# EasyEDA Pro project YYT_MiniOdrive_V2.1（改良开尔文走线）.epro, schematic SCH_SimpleFOC
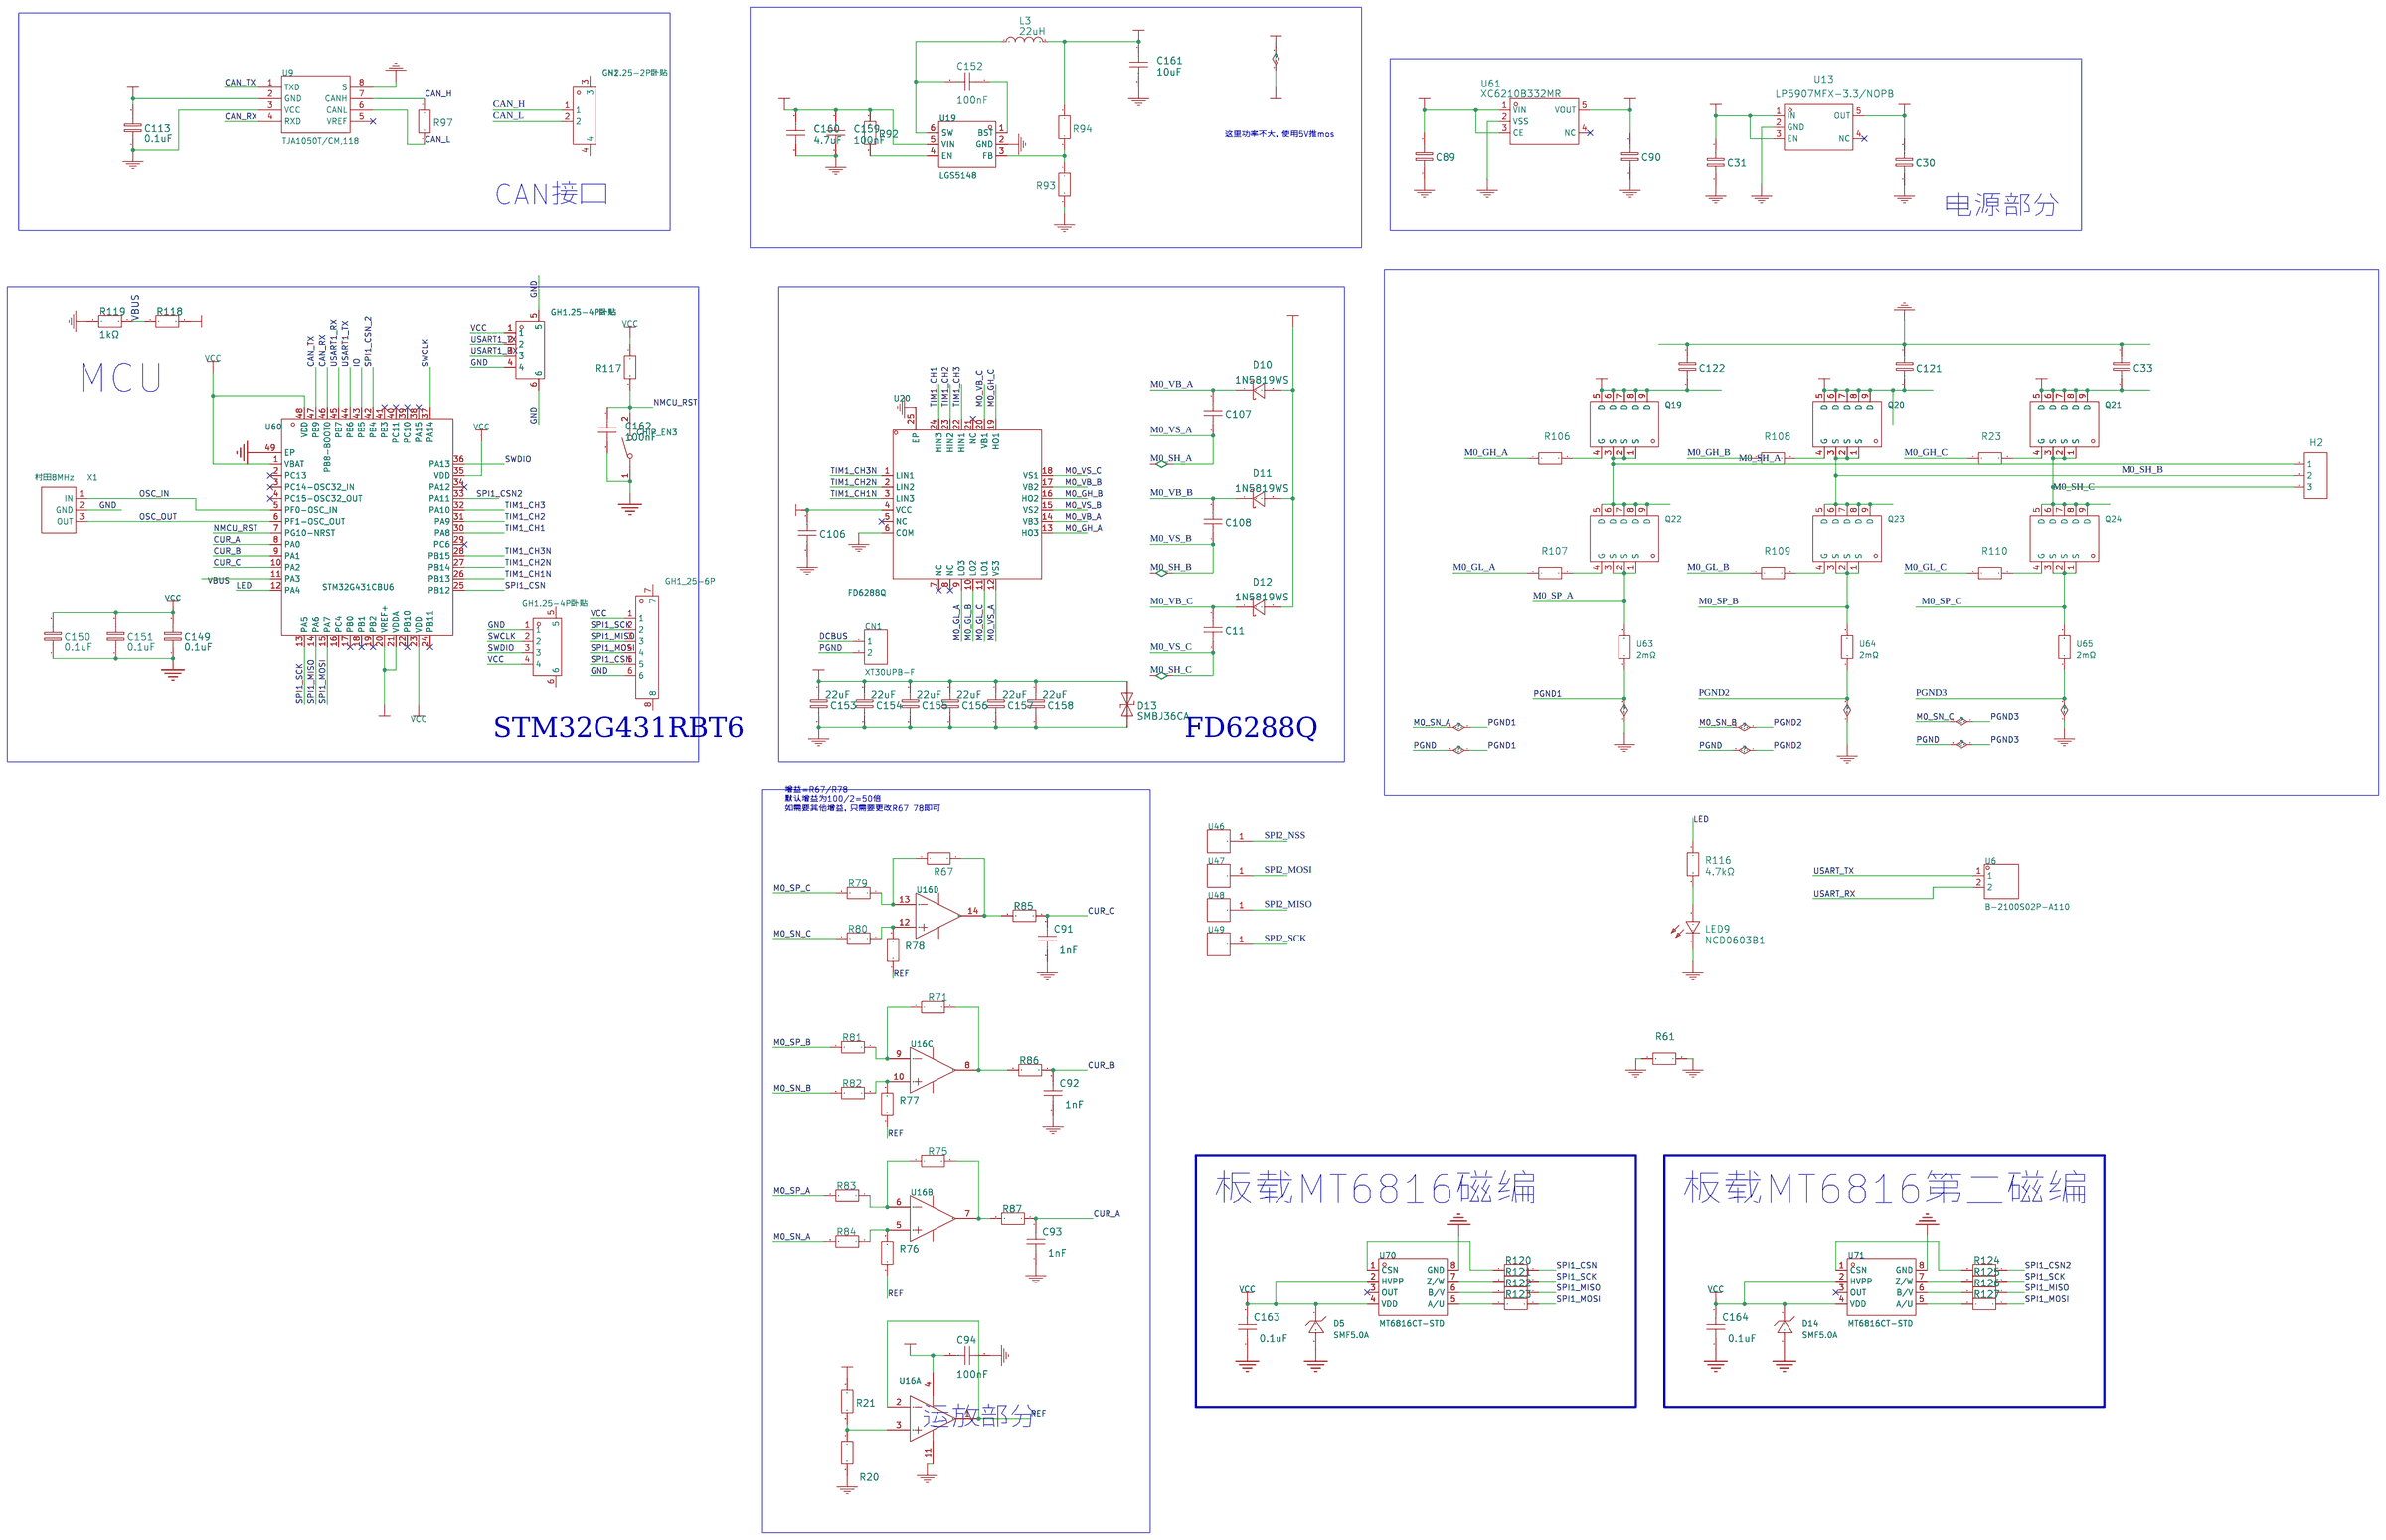
[diagram p0: schematic sheet]

## Parts
C11  1uF  [C0603_SMALL]
C30  1uF  [C0603_SMALL]
C31  1uF  [C0603_SMALL]
C33  10uF  [C1206_SMALL]
C89  10uF  [C0603_SMALL]
C90  10uF  [C0603_SMALL]
C91  1nF  [C0603_SMALL]
C92  1nF  [C0603_SMALL]
C93  1nF  [C0603_SMALL]
C94  100nF  [C0603_SMALL]
C106  10uF  [C0603_SMALL]
C107  1uF  [C0603_SMALL]
C108  1uF  [C0603_SMALL]
C113  0.1uF  [C0603_SMALL]
C121  10uF  [C1206_SMALL]
C122  10uF  [C1206_SMALL]
C149  0.1uF  [C0603_SMALL]
C150  0.1uF  [C0603_SMALL]
C151  0.1uF  [C0603_SMALL]
C152  100nF  [C0603_SMALL]
C153  22uF  [C1206_SMALL]
C154  22uF  [C1206_SMALL]
C155  22uF  [C1206_SMALL]
C156  22uF  [C1206_SMALL]
C157  22uF  [C1206_SMALL]
C158  22uF  [C1206_SMALL]
C159  100nF  [C0603_SMALL]
C160  4.7uF  [C0603_SMALL]
C161  10uF  [C0603_SMALL]
C162  100nF  [C0603_SMALL]
C163  0.1uF  [C0603_SMALL]
C164  0.1uF  [C0603_SMALL]
CHIP_EN3  TS-1088-AR02016  [SW-SMD_L3.9-W3.0-P4.45]
CN1  XT30UPB-F  [CONN-TH_XT30UPB-F]
CN2  GH1.25-2P卧贴  [CONN-SMD_2P-P1.25_X1251WRS-02HF-LPSW]
D5  SMF5.0A  [SOD-123_L2.8-W1.8-LS3.7-RD]
D10  1N5819WS  [SOD-323_L1.8-W1.3-LS2.5-RD]
D11  1N5819WS  [SOD-323_L1.8-W1.3-LS2.5-RD]
D12  1N5819WS  [SOD-323_L1.8-W1.3-LS2.5-RD]
D13  SMBJ36CA  [SMB(DO-214AA)]
D14  SMF5.0A  [SOD-123_L2.8-W1.8-LS3.7-RD]
H2  MR30-M  [MR30-M]
L3  22uH  [IND-SMD_L2.5-W2.0]
LED9  NCD0603B1  [LED0603_RED_SMALL]
Q19  -  [DFN-8_L3.2-W3.1-P0.65-LS3.4-BL]
Q20  -  [DFN-8_L3.2-W3.1-P0.65-LS3.4-BL]
Q21  -  [DFN-8_L3.2-W3.1-P0.65-LS3.4-BL]
Q22  -  [DFN-8_L3.2-W3.1-P0.65-LS3.4-BL]
Q23  -  [DFN-8_L3.2-W3.1-P0.65-LS3.4-BL]
Q24  -  [DFN-8_L3.2-W3.1-P0.65-LS3.4-BL]
R20  1kΩ  [R0603_SMALL]
R21  1kΩ  [R0603_SMALL]
R23  10Ω  [R0603_SMALL]
R61  0Ω  [R0603_SMALL]
R67  100kΩ  [R0603_SMALL]
R71  100kΩ  [R0603_SMALL]
R75  100kΩ  [R0603_SMALL]
R76  100kΩ  [R0603_SMALL]
R77  100kΩ  [R0603_SMALL]
R78  100kΩ  [R0603_SMALL]
R79  2kΩ  [R0603_SMALL]
R80  2kΩ  [R0603_SMALL]
R81  2kΩ  [R0603_SMALL]
R82  2kΩ  [R0603_SMALL]
R83  2kΩ  [R0603_SMALL]
R84  2kΩ  [R0603_SMALL]
R85  22Ω  [R0603_SMALL]
R86  22Ω  [R0603_SMALL]
R87  22Ω  [R0603_SMALL]
R92  10kΩ  [R0603_SMALL]
R93  10kΩ  [R0603_SMALL]
R94  52.3kΩ  [R0603_SMALL]
R97  120Ω  [R0603_SMALL]
R106  10Ω  [R0603_SMALL]
R107  10Ω  [R0603_SMALL]
R108  10Ω  [R0603_SMALL]
R109  10Ω  [R0603_SMALL]
R110  10Ω  [R0603_SMALL]
R116  4.7kΩ  [R0603_SMALL]
R117  10kΩ  [R0603_SMALL]
R118  10kΩ  [R0603_SMALL]
R119  1kΩ  [R0603_SMALL]
R120  22Ω  [R0603_SMALL]
R121  22Ω  [R0603_SMALL]
R122  22Ω  [R0603_SMALL]
R123  22Ω  [R0603_SMALL]
R124  22Ω  [R0603_SMALL]
R125  22Ω  [R0603_SMALL]
R126  22Ω  [R0603_SMALL]
R127  22Ω  [R0603_SMALL]
U6  B-2100S02P-A110  [HDR-TH_2P-P2.54-V-M-1]
U9  TJA1050T/CM,118  [soic-8_l5.0-w4.0-p1.27-ls6.0-bl]
U13  LP5907MFX-3.3/NOPB  [SOT-23-5_L3.0-W1.7-P0.95-LS2.8-BR]
U16  RS724XQ  [TSSOP-14_L5.0-W4.4-P0.65-LS6.4-BL]  (sections 1,2,3,4)
U19  LGS5148  [SOT-23-6_L2.9-W1.6-P0.95-LS2.8-BL]
U20  FD6288Q  [QFN-24_L4.0-W4.0-P0.50-BL-EP2.6]
U46  -  [焊盘]
U47  -  [焊盘]
U48  -  [焊盘]
U49  -  [焊盘]
U60  STM32G431CBU6  [UFQFPN-48_L7.0-W7.0-P0.50-BL-EP]
U61  XC6210B332MR  [SOT-25_L3.0-W1.6-P0.95-LS2.8-BL]
U63  2mΩ  [R1206_SMALL]
U64  2mΩ  [R1206_SMALL]
U65  2mΩ  [R1206_SMALL]
U66  GH1.25-4P卧贴  [CONN-SMD_4P-P1.25_GH1.25-4P]
U67  GH1.25-4P卧贴  [CONN-SMD_4P-P1.25_GH1.25-4P]
U69  GH1_25-6P  [CONN-SMD_A1257WR-S-6P]
U70  MT6816CT-STD  [SOP-8_L4.9-W3.9-P1.27-LS6.0-BL]
U71  MT6816CT-STD  [SOP-8_L4.9-W3.9-P1.27-LS6.0-BL]
X1  村田8MHz  [OSC-SMD_3P-L3.2-W1.3-P1.20]

## Library data of the parts
C11 C30 C31 C91-C93 C107 C108 C152 C159-C164 = CC0603KRX5R8BB105: 容值:1uF;精度:±10%;额定电压:25V;材质(温度系数):X5R;; LCSC Part Name: 1uF ±10% 25V; Supplier Part: C14664; Manufacturer: YAGEO(国巨); Supplier Footprint: 0603; JLCPCB Part Class: Extended Part; Datasheet: https://atta.szlcsc.com/upload/public/pdf/source/20160606/1465200209684.pdf; Supplier: LCSC; Tolerance: ±10%; Voltage Rated: 25V; Temperature Coefficient: X5R; Check: true
C33 C121 C122 C153-C158 = CL31A106KBHNNNE: 容值:10uF;精度:±10%;额定电压:50V;材质(温度系数):X5R;; LCSC Part Name: 10uF ±10% 50V; Supplier Part: C13585; Manufacturer: SAMSUNG(三星); Supplier Footprint: 1206; JLCPCB Part Class: Basic Part; Datasheet: https://atta.szlcsc.com/upload/public/pdf/source/20160218/1457707763339.pdf; Supplier: LCSC; Tolerance: ±10%; Voltage Rated: 50V; Temperature Coefficient: X5R; Check: true
C89 C90 C113 C149-C151 = GRM188R6YA106MA73D: 容值:10uF;精度:±20%;额定电压:35V;材质(温度系数):-;; LCSC Part Name: 10uF ±20% 35V; Supplier Part: C194427; Manufacturer: muRata(村田); Supplier Footprint: 0603; JLCPCB Part Class: Extended Part; Datasheet: https://atta.szlcsc.com/upload/public/pdf/source/20210128/C194427_FCA3640823207DDB58700A82F1A19B5F.pdf; Supplier: LCSC; Tolerance: ±20%; Voltage Rated: 35V; Check: true
C94 = CC0603KRX5R8BB105: 容值:1uF;精度:±10%;额定电压:25V;材质(温度系数):X5R;; LCSC Part Name: 1uF ±10% 25V; Supplier Part: C14663; Manufacturer: YAGEO(国巨); Manufacturer Part: CC0603KRX7R9BB104; Supplier Footprint: 0603; JLCPCB Part Class: Extended Part; Datasheet: https://atta.szlcsc.com/upload/public/pdf/source/20160606/1465200209684.pdf; Supplier: LCSC; Tolerance: ±10%; Voltage Rated: 25V; Temperature Coefficient: X5R; Check: true
C106 = CL10A106MA8NRNC: 容值:10uF;精度:±20%;额定电压:25V;材质(温度系数):X5R;; LCSC Part Name: 10uF ±20% 25V; Supplier Part: C96446; Manufacturer: SAMSUNG(三星); Supplier Footprint: 0603; JLCPCB Part Class: Basic Part; Datasheet: https://atta.szlcsc.com/upload/public/pdf/source/20160218/1457707763339.pdf; Supplier: LCSC; Tolerance: ±20%; Voltage Rated: 25V; Temperature Coefficient: X5R; Check: true
CHIP_EN3 = TS-1088-AR02016: 触点电流:50mA;额定电压(DC):12V;绝缘电阻:100MΩ;电路结构:单刀单掷;安装方式:立贴;作用力:160gf@±50gf;机械寿命:10万次;带支架:否;; LCSC Part Name: 4*3*2mm 立贴 轻触开关; Supplier Part: C720477; Manufacturer: XUNPU(讯普); Supplier Footprint: SMD; JLCPCB Part Class: 扩展库; Datasheet: https://atta.szlcsc.com/upload/public/pdf/source/20200810/C720475_60D09DD6C54279ADDB2DC25100F1CC11.pdf; Supplier: LCSC; Contact Current: 50mA; Voltage Rating (DC): 12V; Insulation Resistance: 100MΩ; Circuit: 单刀单掷; Mounting Style: 立贴; Actuator Style: 圆形按钮; Actuator/Cap Color: 黑色; Operating Force: 160gf@±50gf; Mechanical Life: 10万次; Operating Temperature: -30℃~+80℃; Pin Style: SMD接片; Switch Length: 4mm; Switch Width: 3mm; Switch Height: 2mm; Strike Gundam: 否
CN1 = XT30UPB-F: 模型插头连接器; Supplier Part: C108769; Manufacturer: AMASS(艾迈斯); Supplier Footprint: 间距5mm; JLCPCB Part Class: Extended Part; Datasheet: https://atta.szlcsc.com/upload/public/pdf/source/20180126/C108769_15169557890251308829.pdf; Supplier: LCSC
CN2 = GH1.25-2P卧贴_C9900015099: Supplier Part: C9900015099; JLCPCB Part Class: 扩展库; Supplier: LCSC
D5 D14 = SMF5.0A_C284108: 反向截止电压(Vrwm):5V;最大钳位电压:9.2V;峰值脉冲电流(Ipp)@10/1000us:21.74A;击穿电压:6.4V;; Supplier Part: C284108; Manufacturer: DOWO(东沃); Supplier Footprint: SOD-123; JLCPCB Part Class: 扩展库; Datasheet: https://atta.szlcsc.com/upload/public/pdf/source/20180913/C284108_88CC9DECD7829E4A8E23B214D270FEE7.pdf; Supplier: LCSC; Reverse Stand-Off Voltage (Vrwm): 5V; Maximum Clamping Voltage: 9.2V; Peak Pulse Current (Ipp)@10/1000us: 21.74A; Breakdown Voltage: 6.4V; Type: TVS
D10-D12 = 1N5819WS_C191023: 直流反向耐压(Vr):40V;平均整流电流(Io):1A;正向压降(Vf):600mV@1A;; LCSC Part Name: 40V 1A 600mV@1A; Supplier Part: C191023; Manufacturer: Hottech(合科泰); Supplier Footprint: SOD-323; JLCPCB Part Class: Basic Part; Datasheet: https://atta.szlcsc.com/upload/public/pdf/source/20220428/3CB86FD8D28D653594B4E35F9D5AEFD9.pdf; Supplier: LCSC; Reverse Voltage (Vr): 40V; Average Rectified Current (Io): 1A; Forward Voltage (Vf@If): 600mV@1A
D13 = SMBJ36CA_C114002: 极性:双向;反向截止电压(Vrwm):36V;击穿电压(最小值):40V;峰值脉冲电流(Ipp)@10/1000μs:10.3A;最大钳位电压:58.1V;; LCSC Part Name: 双向 36V; Supplier Part: C114002; Manufacturer: MDD; JLCPCB Part Class: Extended Part; Datasheet: https://atta.szlcsc.com/upload/public/pdf/source/20180124/C114002_15167561198911295053.pdf; Supplier: LCSC; Polarity: 双向; Reverse Stand-Off Voltage (Vrwm): 36V; Breakdown Voltage (Min): 40V; Peak Pulse Current (Ipp)@10/1000μs: 10.3A; Maximum Clamping Voltage: 58.1V
H2 = MR30-M: Supplier Part: C146690; Supplier: LCSC; Check: true
L3 = FTC252012S100MBCA: 电感值:10uH;精度:±20%;额定电流:1.2A;饱和电流(Isat):1.6A;类型:一体成型电感;; LCSC Part Name: 10uH ±20% 1.6A; Supplier Part: C5832376; Manufacturer: cjiang(长江微电); Supplier Footprint: SMD,2x2.5mm; JLCPCB Part Class: Extended Part; Datasheet: https://atta.szlcsc.com/upload/public/pdf/source/20230602/8FFEDA9C0247A92A0D4B67554BFE4091.pdf; Supplier: LCSC; Tolerance: ±20%; Rated Current: 1.2A; Saturation Current (Isat): 1.6A; DC Resistance (DCR): 330mΩ; Type: 一体成型电感
LED9 = NCD0603B1: 发光颜色:蓝灯;; LCSC Part Name: 蓝灯; Supplier Part: C84266; Manufacturer: 国星光电; Supplier Footprint: 0603; JLCPCB Part Class: Extended Part; Datasheet: https://atta.szlcsc.com/upload/public/pdf/source/20200820/C84266_6A3CDBEFA72C6CAD68EDA53474ADAE6C.pdf; Supplier: LCSC; Emitted Color: 蓝灯
Q19-Q24 = AP30H50Q: 类型:N沟道;漏源电压(Vdss):30V;连续漏极电流(Id):40A;功率(Pd):30W;导通电阻(RDS(on)@Vgs,Id):6.5m@10V,15A;阈值电压(Vgs(th)@Id):1.5V@250uA;栅极电荷(Qg@Vgs):13.3nC@10V;输入电容(Ciss@Vds):1.116nF@15V;反向传输电容(Crss@Vds):152pF@15V;工作温度:+150@(Tj);; LCSC Part Name: N沟道 30V 40A; Supplier Part: C2849568; Manufacturer: ALLPOWER(铨力); Supplier Footprint: PDFN3x3-8L; Datasheet: https://atta.szlcsc.com/upload/public/pdf/source/20210723/C2849568_A97FA0A1CF9FB2B108B0B183000AF288.pdf; Supplier: LCSC; Type: N沟道; Drain Source Voltage (Vdss): 30V; Continuous Drain Current (Id): 40A; Power Dissipation (Pd): 30W; Drain Source On Resistance (RDS(on)@Vgs,Id): 6.5m@10V,15A; Gate Threshold Voltage (Vgs(th)@Id): 1.5V@250uA; Total Gate Charge (Qg@Vgs): 13.3nC@10V; Input Capacitance (Ciss@Vds): 1.116nF@15V; Reverse Transfer Capacitance (Crss@Vds): 152pF@15V; Operating Temperature: +150@(Tj); JLCPCB Part Class: Extended Part
R20 R21 = SCR0603J1K: 阻值:1kΩ;精度:±5%;; LCSC Part Name: 1kΩ ±5%; Supplier Part: C3017736; Manufacturer: VO(翔胜); Supplier Footprint: 0603; JLCPCB Part Class: Extended Part; Datasheet: https://atta.szlcsc.com/upload/public/pdf/source/20220513/247AF9639BA21CF93567DC289CCC6A22.pdf; Supplier: LCSC; Tolerance: ±5%; Check: true
R23 R106-R110 = 0603WAF100JT5E: 电阻类型:厚膜电阻;阻值:10Ω;精度:±1%;功率:100mW;最大工作电压:75V;温度系数:±400ppm/℃;; LCSC Part Name: 10Ω ±1% 100mW 厚膜电阻; Supplier Part: C22859; Manufacturer: UNI-ROYAL(厚声); Supplier Footprint: 0603; JLCPCB Part Class: Basic Part; Datasheet: https://atta.szlcsc.com/upload/public/pdf/source/20200306/C422600_1E6D84923E4A46A82E41ADD87F860B5C.pdf; Supplier: LCSC; Type: 厚膜电阻; Tolerance: ±1%; Power(Watts): 100mW; Overload Voltage (Max): 75V; Temperature Coefficient: ±400ppm/℃; Operating Temperature Range: -55℃~+155℃; Check: true
R61 = 0603WAF0000T5E: 电阻类型:厚膜电阻;阻值:0Ω;精度:±1%;功率:100mW;最大工作电压:75V;; LCSC Part Name: 0Ω ±1% 100mW 厚膜电阻; Supplier Part: C21189; Manufacturer: UNI-ROYAL(厚声); Supplier Footprint: 0603; JLCPCB Part Class: Basic Part; Datasheet: https://atta.szlcsc.com/upload/public/pdf/source/20200306/C422600_1E6D84923E4A46A82E41ADD87F860B5C.pdf; Supplier: LCSC; Type: 厚膜电阻; Tolerance: ±1%; Power(Watts): 100mW; Overload Voltage (Max): 75V; Operating Temperature Range: -55℃~+155℃; Check: true
R67 R71 R75-R78 = RT0603BRD07100KL: 电阻类型:薄膜电阻;阻值:100kΩ;精度:±0.1%;功率:100mW;; LCSC Part Name: 100kΩ ±0.1% 100mW; Supplier Part: C122538; Manufacturer: YAGEO(国巨); Supplier Footprint: 0603; JLCPCB Part Class: Extended Part; Datasheet: https://atta.szlcsc.com/upload/public/pdf/source/20170721/C122538_1500619326323834092.pdf; Supplier: LCSC; Type: 薄膜电阻; Tolerance: ±0.1%; Power(Watts): 100mW; Temperature Coefficient: ±25ppm/℃; Overload Voltage (Max): 75V; Operating Temperature Range: -55℃~+155℃; Check: true
R79-R84 = 0603WAF2001T5E: 阻值:2kΩ;精度:±1%;功率:100mW;温度系数:±100ppm/℃;电阻类型:厚膜电阻;; LCSC Part Name: 2kΩ ±1% 100mW 厚膜电阻; Supplier Part: C22975; Manufacturer: UNI-ROYAL(厚声); Supplier Footprint: 0603; JLCPCB Part Class: Basic Part; Datasheet: https://atta.szlcsc.com/upload/public/pdf/source/20200306/C422600_1E6D84923E4A46A82E41ADD87F860B5C.pdf; Supplier: LCSC; Tolerance: ±1%; Power(Watts): 100mW; Overload Voltage (Max): 75V; Temperature Coefficient: ±100ppm/℃; Type: 厚膜电阻; Operating Temperature Range: -55℃~+155℃; Check: true
R85-R87 R120-R127 = 0603WAF220JT5E: 阻值:22Ω;精度:±1%;功率:100mW;温度系数:±100ppm/℃;电阻类型:厚膜电阻;; LCSC Part Name: 22Ω ±1% 100mW 厚膜电阻; Supplier Part: C23345; Manufacturer: UNI-ROYAL(厚声); Supplier Footprint: 0603; JLCPCB Part Class: Basic Part; Datasheet: https://atta.szlcsc.com/upload/public/pdf/source/20200306/C422600_1E6D84923E4A46A82E41ADD87F860B5C.pdf; Supplier: LCSC; Tolerance: ±1%; Power(Watts): 100mW; Overload Voltage (Max): 75V; Temperature Coefficient: ±100ppm/℃; Type: 厚膜电阻; Operating Temperature Range: -55℃~+155℃; Check: true
R92 R93 R117-R119 = CR0603JA0103G: 电阻类型:厚膜电阻;阻值:10kΩ;精度:±5%;功率:100mW;温度系数:±200ppm/℃;最大工作电压:50V;工作温度范围:-55℃~+125℃;; LCSC Part Name: 10kΩ ±5% 100mW; Supplier Part: C101254; Manufacturer: LIZ(丽智电子); Supplier Footprint: 0603; JLCPCB Part Class: Extended Part; Datasheet: https://atta.szlcsc.com/upload/public/pdf/source/20170408/1491631441449.pdf; Supplier: LCSC; Type: 厚膜电阻; Tolerance: ±5%; Power(Watts): 100mW; Temperature Coefficient: ±200ppm/℃; Overload Voltage (Max): 50V; Operating Temperature Range: -55℃~+125℃; Check: true
R94 = 0603WAF5232T5E: 电阻类型:厚膜电阻;阻值:52.3kΩ;精度:±1%;功率:100mW;最大工作电压:75V;温度系数:±100ppm/℃;; LCSC Part Name: 52.3kΩ ±1% 100mW 厚膜电阻; Supplier Part: C23198; Manufacturer: UNI-ROYAL(厚声); Supplier Footprint: 0603; JLCPCB Part Class: Extended Part; Datasheet: https://atta.szlcsc.com/upload/public/pdf/source/20200306/C422600_1E6D84923E4A46A82E41ADD87F860B5C.pdf; Supplier: LCSC; Type: 厚膜电阻; Tolerance: ±1%; Power(Watts): 100mW; Overload Voltage (Max): 75V; Temperature Coefficient: ±100ppm/℃; Operating Temperature Range: -55℃~+155℃; Check: true
R97 = RC0603FR-07120RL: 阻值:120Ω;精度:±1%;功率:100mW;温度系数:±100ppm/℃;最大工作电压:75V;工作温度范围:-55℃~+155℃;; LCSC Part Name: 120Ω ±1% 100mW; Supplier Part: C114640; Manufacturer: YAGEO(国巨); Supplier Footprint: 0603; JLCPCB Part Class: Extended Part; Datasheet: https://atta.szlcsc.com/upload/public/pdf/source/20170818/C114640_1503051151018895125.pdf; Supplier: LCSC; Tolerance: ±1%; Power(Watts): 100mW; Temperature Coefficient: ±100ppm/℃; Overload Voltage (Max): 75V; Operating Temperature Range: -55℃~+155℃; Check: true
R116 = CR0603J22R0P05Z: 阻值:22Ω;精度:±5%;功率:100mW;温度系数:±100ppm/℃;; LCSC Part Name: 22Ω ±5% 100mW; Supplier Part: C881386; Manufacturer: EVER OHMS(天二科技); Supplier Footprint: 0603; JLCPCB Part Class: Extended Part; Datasheet: https://atta.szlcsc.com/upload/public/pdf/source/20201014/C881429_ABC29D63C8D6A11EB63D87348B25AA7B.pdf; Supplier: LCSC; Tolerance: ±5%; Power(Watts): 100mW; Temperature Coefficient: ±100ppm/℃; Check: true
U6 = B-2100S02P-A110: 插针结构:1x2P;间距:2.54mm;行距:-;圆针/方针:-;安装类型:直插;排数:单排;总PIN位数:2P;额定电流:-;额定电压:-;配合针长度:6mm;塑高:2.54mm;端接针长度:3mm;触头材质:黄铜;触头镀层:-;工作温度范围:-40℃~+105℃;颜色:黑色;; LCSC Part Name: 间距:2.54mm 1x2P 直插; Supplier Part: C124375; Manufacturer: Ckmtw(灿科盟); Supplier Footprint: 插件,P=2.54mm; JLCPCB Part Class: 扩展库; Datasheet: https://atta.szlcsc.com/upload/public/pdf/source/20221019/2EE72DAC61CAA62C0A53546E211F9C15.pdf; Supplier: LCSC; Pin Structure: 1x2P; Pitch: 2.54mm; Mounting Type: 直插; Number of Rows: 单排; Number of Pins: 2P; Length of Mating Pin: 6mm; Insulation Height: 2.54mm; Length of End Connection Pin: 3mm; Contact Material: 黄铜; Operating Temperature Range: -40℃~+105℃; Color: 黑色
U9 = TJA1050T/CM,118: 类型:收发器;; LCSC Part Name: 4.75V~5.25V; Supplier Part: C6952; Manufacturer: NXP(恩智浦); Supplier Footprint: SOP-8; JLCPCB Part Class: 扩展库; Datasheet: https://atta.szlcsc.com/upload/public/pdf/source/20140411/1457707042917.pdf; Supplier: LCSC; Type: 收发器; Supply Voltage: 4.75V~5.25V; Supply Current: 50mA
U13 = LP5907MFX-3.3/NOPB: 输出类型:固定;输出极性:正;输出通道数:1;最大输入电压:5.5V;输出电压:3.3V;压差:250mV@(250mA);输出电流:250mA;电源纹波抑制比(PSRR):90dB;; LCSC Part Name: 正 Vin=5.5V Vout=3.3V 250mA 90dB; Supplier Part: C80670; Manufacturer: TI(德州仪器); Supplier Footprint: SOT-23-5; JLCPCB Part Class: Extended Part; Datasheet: https://atta.szlcsc.com/upload/public/pdf/source/20160830/1472551528598.pdf; Supplier: LCSC; Output Type: 固定; Output Polarity: 正; Number of Outputs: 1; Maximum Input Voltage: 5.5V; Output Voltage: 3.3V; Dropout Voltage: 250mV@(250mA); Output Current: 250mA; Power Supply Rejection Ratio (PSRR): 90dB; Power Supply Rejection Ratio (PRSS): 90dB@(100Hz),60dB@(100kHz)
U16 = RS724XQ: 超低噪声9.5nV/√Hz,10MHz,4通道运放; LCSC Part Name: 低噪声运放RS724XQ; Supplier Part: C255447; Manufacturer: RUNIC(润石); Supplier Footprint: TSSOP-14; JLCPCB Part Class: 扩展库; Datasheet: https://atta.szlcsc.com/upload/public/pdf/source/20180801/C255447_BE3BEC7F638DC7BEBCC129246595435E.pdf; Supplier: LCSC
U19 = LGS5148: 功能类型:降压型;输出类型:可调;输入电压:4.5V~48V;输出电压:800mV~48V;输出电流(最大值):600mA;; Supplier Part: C5123972; Manufacturer: Legend-Si(棱晶半导体); Supplier Footprint: SOT-23-6; JLCPCB Part Class: 扩展库; Datasheet: https://atta.szlcsc.com/upload/public/pdf/source/20230407/A0D7A27017FB3DB511660556CA18A0F6.pdf; Supplier: LCSC; Function: 降压型; Output Type: 可调; Input Voltage: 4.5V~48V; Output Voltage: 800mV~48V; Output Current (Max): 600mA; Switching Frequency: 900kHz; Operating Temperature: -40℃~+125℃@(TJ); Synchronous Rectification: 是; Number of Outputs: 1; Topology: 降压式; Quiescent Current (Iq): 200uA; Switch tube (built-in/external): 内置
U20 = FD6288Q: Supplier Part: C328453; Manufacturer: Fortior Tech(峰岹); Supplier Footprint: QFN-24-EP(4x4); JLCPCB Part Class: 扩展库; Datasheet: https://atta.szlcsc.com/upload/public/pdf/source/20181108/C328453_785547738DB9FC0123219FC22539EFAD.pdf; Supplier: LCSC
U46-U49 = 焊盘
U60 = STM32G431CBU6: CPU内核:ARM-M系列;程序存储容量:128KB;RAM总容量:32KB;GPIO端口数量:42;工作电压范围:1.71V~3.6V;CPU最大主频:170MHz;程序存储器类型:FLASH;; Supplier Part: C529356; Manufacturer: ST(意法半导体); Supplier Footprint: UFQFPN-48(7x7); JLCPCB Part Class: 扩展库; Datasheet: https://atta.szlcsc.com/upload/public/pdf/source/20200511/C529354_7C66CF00837B904D0C15DCE45B69418C.pdf; Supplier: LCSC; CPU Core: ARM-M系列; Program Storage Size: 128KB; RAM Size: 32KB; GPIO Ports Number: 42; Operating Voltage Range: 1.71V~3.6V; CPU Maximum Speed: 170MHz; Program Memory Type: FLASH; Operating Temperature Range: -40℃~+85℃; ADC (Bit): 12bit; DAC (Bit): 12bit; Peripheral/Function: DMA；PWM; Watchdog: 有; Infrared Data Association: 有; Low-Voltage Detect: 有; Direct Memory Access: 有; Internal Oscillator: 有
U61 = XC6210B332MR_C424705: 输出类型:固定;输出极性:正;输出通道数:1;最大输入电压:6V;输出电压:3.3V;压差:75mV@(100mA);输出电流:900mA;电源纹波抑制比(PRSS):60dB@(1kHz);; LCSC Part Name: Vin=6V Vout=3.3V 900mA 60dB@(1kHz); Supplier Part: C424705; Manufacturer: TOREX(特瑞仕); Supplier Footprint: SOT-25; JLCPCB Part Class: Extended Part; Datasheet: https://atta.szlcsc.com/upload/public/pdf/source/20190903/C424705_1DFB2113A9A78D399905DBF688657204.pdf; Supplier: LCSC; Output Type: 固定; Output Polarity: 正; Number of Outputs: 1; Maximum Input Voltage: 6V; Output Voltage: 3.3V; Dropout Voltage: 75mV@(100mA); Output Current: 900mA; Power Supply Rejection Ratio (PRSS): 60dB@(1kHz)
U63-U65 = HoLLR1206-1W-5mR-1%: 电阻类型:采样电阻;阻值:5mΩ;精度:±1%;额定压降:-;功率:1W;温度系数:±50ppm/℃;安装方式:贴片;; LCSC Part Name: 5mΩ ±1% 1W; Supplier Part: C2988648; Manufacturer: Milliohm(毫欧); Supplier Footprint: 1206; JLCPCB Part Class: 扩展库; Datasheet: https://atta.szlcsc.com/upload/public/pdf/source/20220407/F189C92CC2C10DCB4BF36375122B9E11.pdf; Supplier: LCSC; Type: 采样电阻; Tolerance: ±1%; Power(Watts): 1W; Rated Current: 31.6A; Temperature Coefficient: ±50ppm/℃; Mounting Sytle: 贴片
U66 U67 = GH1.25-4P卧贴: Supplier Part: C9900014670; JLCPCB Part Class: 扩展库; Supplier: LCSC
U69 = GH1_25-6P: Supplier Part: C9900006824; JLCPCB Part Class: 扩展库; Supplier: LCSC
U70 U71 = MT6816CT-STD: 零延迟磁角位置传感器IC; LCSC Part Name: 磁位置传感器; Supplier Part: C2925077; Manufacturer: MagnTek(麦歌恩); Supplier Footprint: SOP-8; JLCPCB Part Class: 扩展库; Datasheet: https://atta.szlcsc.com/upload/public/pdf/source/20211202/34073ED58EE6E476BE477C7F05608C83.pdf; Supplier: LCSC
X1 = 村田8MHz: Supplier: LCSC; Supplier Part: C907975; Manufacturer: muRata(村田); Manufacturer Part: CSTNE8M00G520000R0; JLCPCB Part Class: Extended Part

## Nets
5V: C31.2 C89.2 C106.1 C113.2 C161.1 D10.2(A) D11.2(A) D12.2(A) L3.2 R94.1 U9.2(GND) U13.1(IN) U13.3(EN) U20.4(VCC) U61.1(VIN) U61.3(CE)
AVCC: C30.2 C94.2 R21.1 U13.5(OUT) U16.4(V+) U60.20(VREF+) U60.21(VDDA)
GND: C30.1 C31.1 C89.1 C90.1 C91.1 C92.1 C93.1 C94.1 C106.2 C113.1 C149.1 C150.1 C151.1 C159.2 C160.2 C161.2 C162.2 C163.1 C164.1 CHIP_EN3.1 D5.2 D14.2 LED9.1(K) R20.2 R61.2 R93.2 R119.1 U9.3(VCC) U9.8(S) U13.2(GND) U16.11(V-) U19.2(GND) U20.6(COM) U20.25(EP) U60.49(EP) U61.2(VSS) U66.1 U67.4 U67.5 U67.6 U69.6 U70.8(GND) U71.8(GND) X1.2(GND)
PGND: C33.1 C121.1 C122.1 C153.2 C154.2 C155.2 C156.2 C157.2 C158.2 CN1.2 D13.2(A) R61.1 R80.2 R82.2 R84.2 U63.1 U64.1 U65.1
VBUS: R118.1 R119.2 U60.11(PA3)
VCC: C90.2 C149.2 C150.2 C151.2 C163.2 C164.2 D5.1 D14.1 R117.1 U60.1(VBAT) U60.23(VDD) U60.35(VDD) U60.48(VDD) U61.5(VOUT) U66.4 U67.1 U69.1 U70.2(HVPP) U70.4(VDD) U71.2(HVPP) U71.4(VDD)
CAN_H: CN2.1 R97.1 U9.7(CANH)
CAN_L: CN2.2 R97.2 U9.6(CANL)
CAN_RX: U9.4(RXD) U60.46(PB8-BOOT0)
CAN_TX: U9.1(TXD) U60.47(PB9)
CUR_A: C93.2 R87.1 U60.8(PA0)
CUR_B: C92.2 R86.1 U60.9(PA1)
CUR_C: C91.2 R85.1 U60.10(PA2)
DCBUS: C33.2 C121.2 C122.2 C153.1 C154.1 C155.1 C156.1 C157.1 C158.1 C159.1 C160.1 CN1.1 D13.1(K) Q19.5(D) Q19.6(D) Q19.7(D) Q19.8(D) Q19.9(D) Q20.5(D) Q20.6(D) Q20.7(D) Q20.8(D) Q20.9(D) Q21.5(D) Q21.6(D) Q21.7(D) Q21.8(D) Q21.9(D) R92.1 R118.2 U19.5(VIN)
IO: U60.43(PB5)
LED: R116.1 U60.12(PA4)
M0_GH_A: R106.1 U20.13(HO3)
M0_GH_B: R108.1 U20.16(HO2)
M0_GH_C: R23.1 U20.19(HO1)
M0_GL_A: R107.1 U20.9(LO3)
M0_GL_B: R109.1 U20.10(LO2)
M0_GL_C: R110.1 U20.11(LO1)
M0_SH_A: C107.1 H2.3(1) Q19.1(S) Q19.2(S) Q19.3(S) Q22.5(D) Q22.6(D) Q22.7(D) Q22.8(D) Q22.9(D) U20.12(VS3)
M0_SH_B: C108.1 H2.2 Q20.1(S) Q20.2(S) Q20.3(S) Q23.5(D) Q23.6(D) Q23.7(D) Q23.8(D) Q23.9(D) U20.15(VS2)
M0_SH_C: C11.1 H2.1(3) Q21.1(S) Q21.2(S) Q21.3(S) Q24.5(D) Q24.6(D) Q24.7(D) Q24.8(D) Q24.9(D) U20.18(VS1)
M0_SP_A: Q22.1(S) Q22.2(S) Q22.3(S) R83.2 U63.2
M0_SP_B: Q23.1(S) Q23.2(S) Q23.3(S) R81.2 U64.2
M0_SP_C: Q24.1(S) Q24.2(S) Q24.3(S) R79.2 U65.2
M0_VB_A: C107.2 D10.1(C) U20.14(VB3)
M0_VB_B: C108.2 D11.1(C) U20.17(VB2)
M0_VB_C: C11.2 D12.1(C) U20.20(VB1)
NMCU_RST: C162.1 CHIP_EN3.2 R117.2 U60.7(PG10-NRST)
OSC_IN: U60.5(PF0-OSC_IN) X1.1(IN)
OSC_OUT: U60.6(PF1-OSC_OUT) X1.3(OUT)
REF: R76.1 R77.1 R78.1 U16.1(OUTA) U16.2(-INA)
SPI1_CSN: R120.1 U60.25(PB12) U69.5
SPI1_CSN2: R124.1 U60.33(PA11)
SPI1_CSN_2: U60.42(PB4)
SPI1_MISO: R122.1 R126.1 U60.14(PA6) U69.3
SPI1_MOSI: R123.1 R127.1 U60.15(PA7) U69.4
SPI1_SCK: R121.1 R125.1 U60.13(PA5) U69.2
SPI2_MISO: U48.1
SPI2_MOSI: U47.1
SPI2_NSS: U46.1
SPI2_SCK: U49.1
SWCLK: U60.37(PA14) U66.2
SWDIO: U60.36(PA13) U66.3
TIM1_CH1: U20.24(HIN3) U60.30(PA8)
TIM1_CH1N: U20.3(LIN3) U60.26(PB13)
TIM1_CH2: U20.23(HIN2) U60.31(PA9)
TIM1_CH2N: U20.2(LIN2) U60.27(PB14)
TIM1_CH3: U20.22(HIN1) U60.32(PA10)
TIM1_CH3N: U20.1(LIN1) U60.28(PB15)
USART1_RX: U60.45(PB7) U67.3
USART1_TX: U60.44(PB6) U67.2
USART_RX: U6.2
USART_TX: U6.1
$1N155002: LED9.2(A) R116.2
$1N159844: Q21.4(G) R23.2
$1N159848: Q19.4(G) R106.2
$1N159849: Q20.4(G) R108.2
$1N159852: Q24.4(G) R110.2
$1N159862: Q23.4(G) R109.2
$1N159870: Q22.4(G) R107.2
$1N176512: R20.1 R21.2 U16.3(+INA)
$1N176515: R71.2 R86.2 U16.8(OUTC)
$1N176518: R71.1 R81.1 U16.9(-INC)
$1N176519: R77.2 R82.1 U16.10(+INC)
$1N176520: R76.2 R84.1 U16.5(+INB)
$1N176521: R75.1 R83.1 U16.6(-INB)
$1N176522: R75.2 R87.2 U16.7(OUTB)
$1N176541: R67.2 R85.2 U16.14(OUTD)
$1N176544: R78.2 R80.1 U16.12(+IND)
$1N176545: R67.1 R79.1 U16.13(-IND)
$1N177495: C152.1 U19.1(BST)
$1N177496: C152.2 L3.1 U19.6(SW)
$1N177500: R93.1 R94.2 U19.3(FB)
$1N177501: R92.2 U19.4(EN)
$1N187186: R120.2 U70.1(CSN)
$1N187228: R121.2 U70.7(Z/W)
$1N187273: R122.2 U70.6(B/V)
$1N187318: R123.2 U70.5(A/U)
$1N193710: R126.2 U71.6(B/V)
$1N193711: R127.2 U71.5(A/U)
$1N193712: R124.2 U71.1(CSN)
$1N193722: R125.2 U71.7(Z/W)

Not connected (* = marked no-connect by the designer): CN2 3 4; U9 5(VREF)*; U13 4(NC)*; U20 5(NC)* 7(NC)* 8(NC)* 21(NC)*; U60 2(PC13)* 3(PC14-OSC32_IN)* 4(PC15-OSC32_OUT)* 16(PC4) 17(PB0)* 18(PB1)* 19(PB2)* 22(PB10)* 24(PB11)* 29(PC6)* 34(PA12)* 38(PA15)* 39(PC10)* 40(PC11)* 41(PB3)*; U61 4(NC)*; U66 5 6; U69 7 8; U70 3(OUT)*; U71 3(OUT)*

## Notes on the sheet
- 这里功率不大，使用5V推mos
- CAN接口
- 电源部分
- MCU
- STM32G431RBT6
- FD6288Q
- 增益=R67/R78
  默认增益为100/2=50倍
  如需要其他增益，只需要更改R67 78即可
- 板载MT6816磁编
- 板载MT6816第二磁编
- 运放部分
